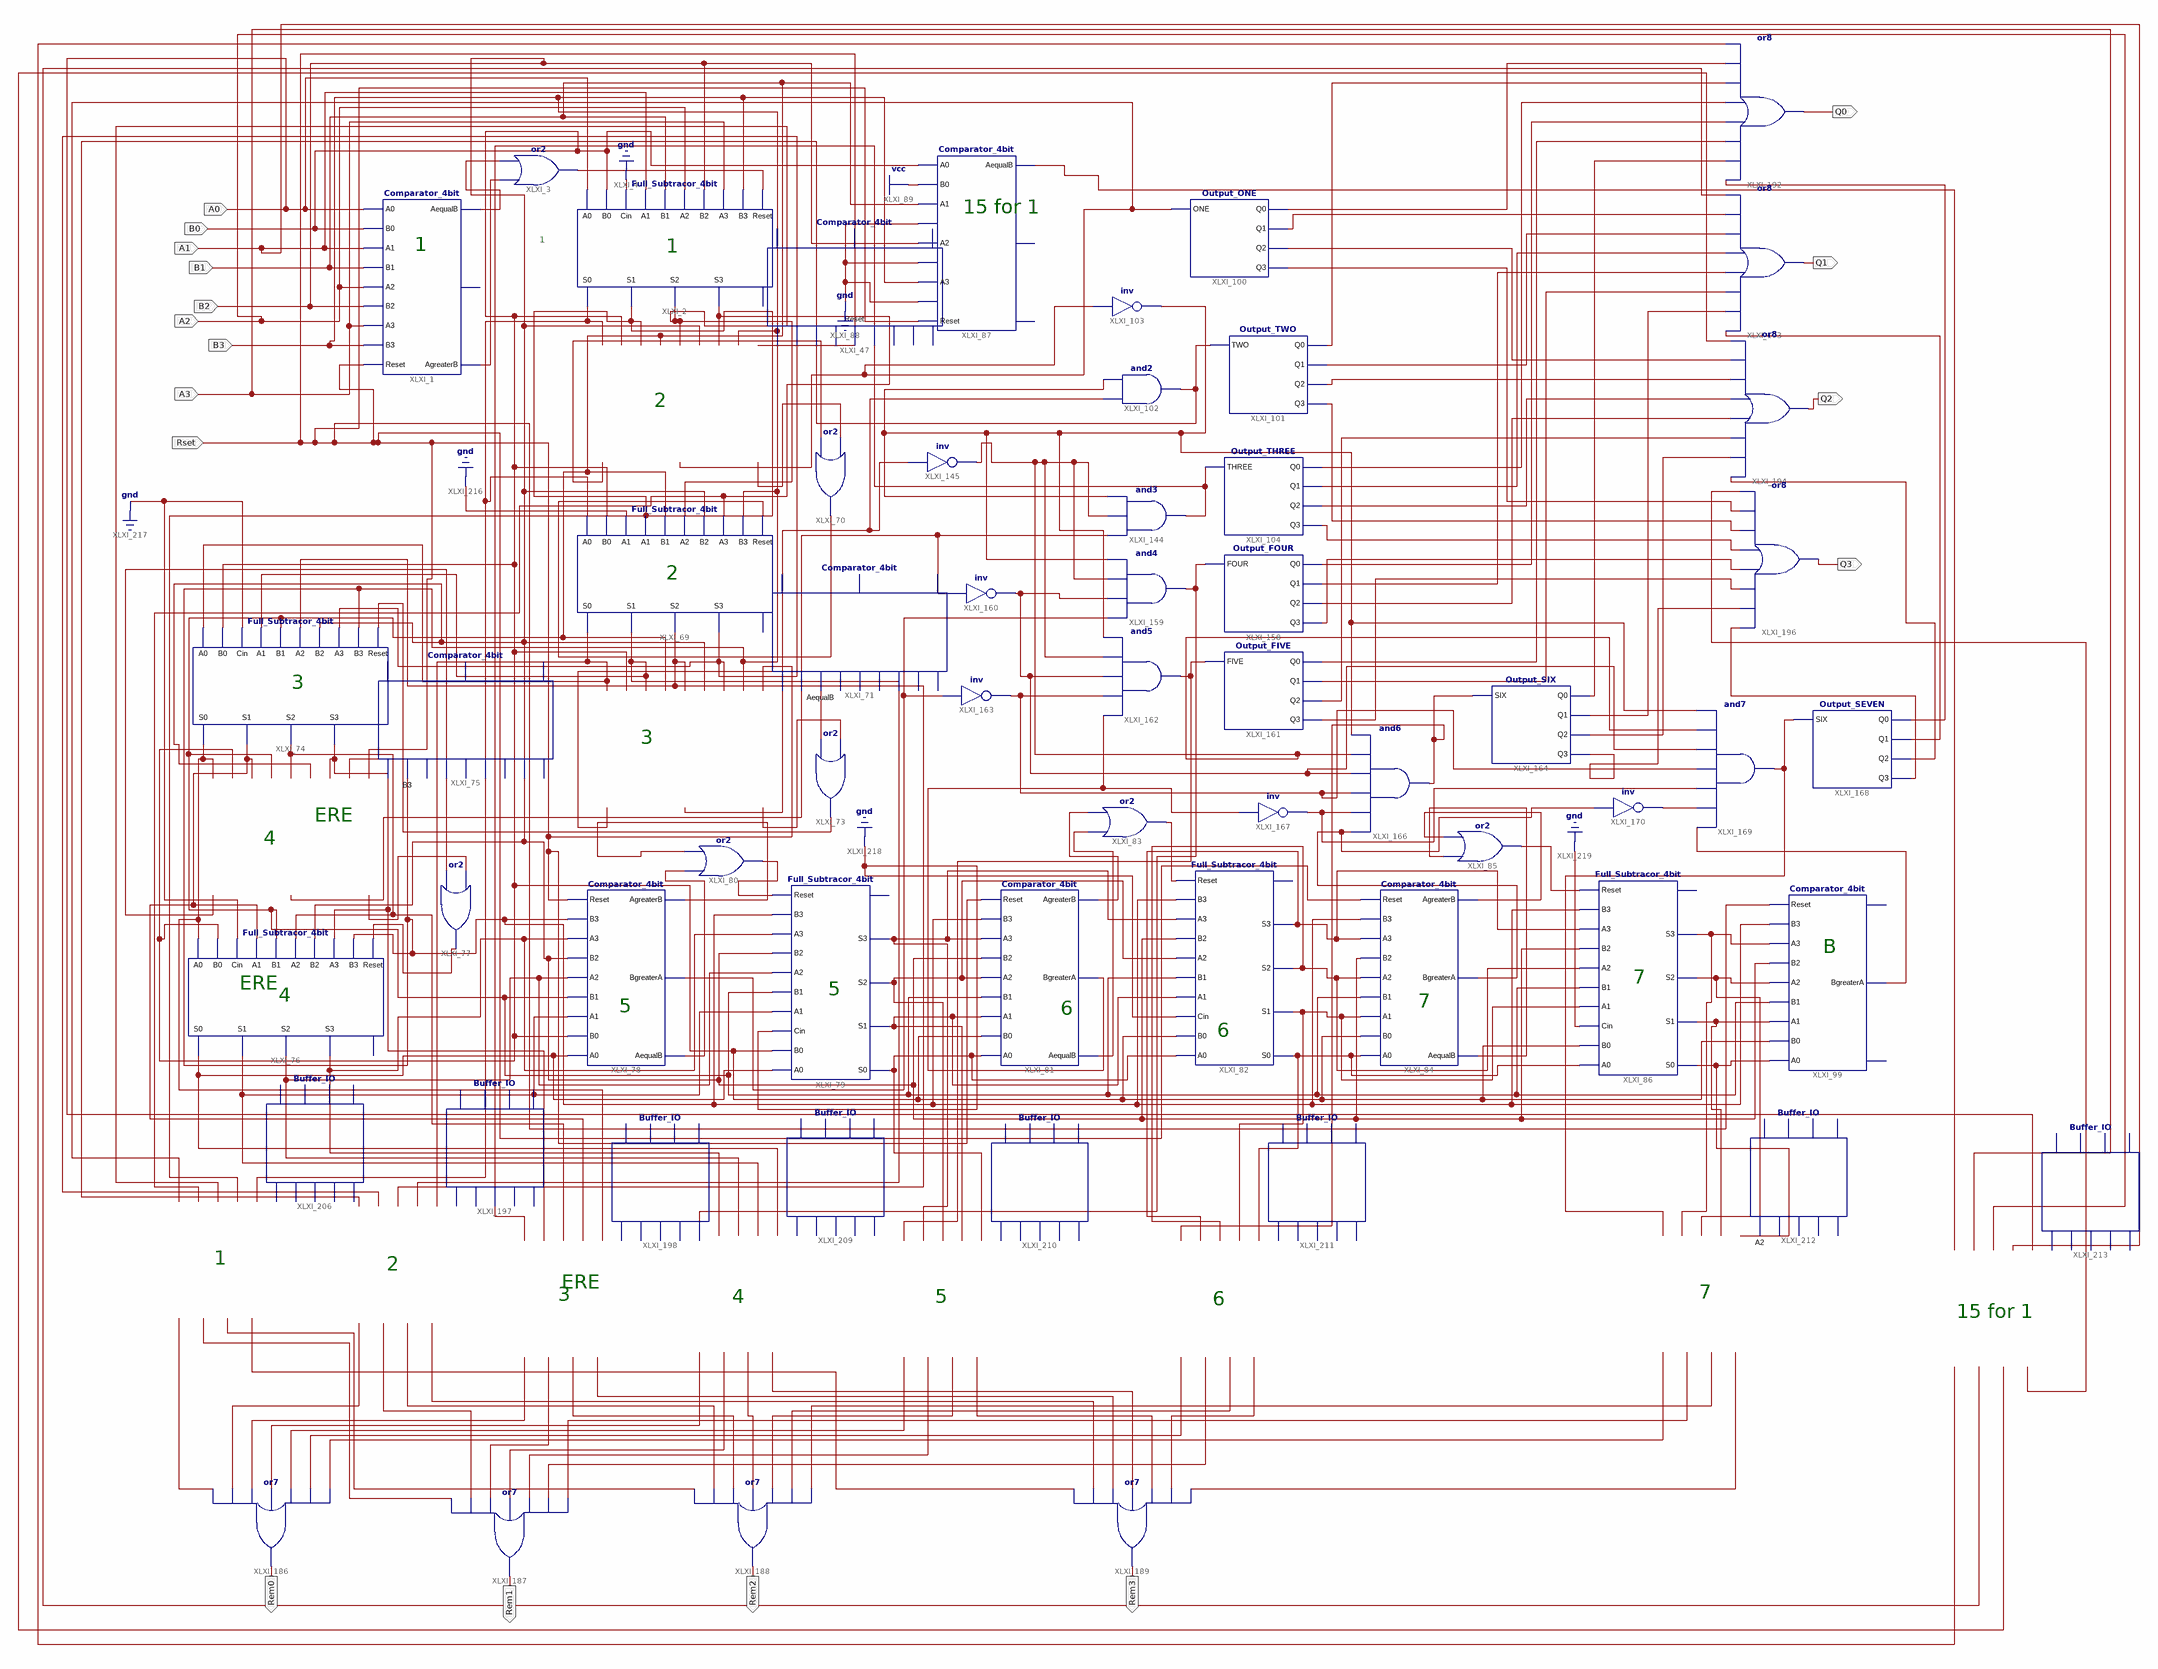
[diagram p0: schematic sheet 1]
// Xilinx ISE schematic Divider_2att.sch (artix7) as structural Verilog: 58 symbols, 17 ports
module Divider_2att (
  input  A2,
  input  A3,
  input  A1,
  input  A0,
  input  B0,
  input  B1,
  input  B2,
  input  B3,
  input  Rset,
  output Q0,
  output Q1,
  output Q2,
  output Rem0,
  output Rem1,
  output Rem2,
  output Rem3,
  output Q3
);

  wire XLXN_6, XLXN_7, XLXN_8, XLXN_124, XLXN_125, XLXN_130, XLXN_131, XLXN_136, XLXN_138, XLXN_139,
       XLXN_140, XLXN_142, XLXN_144, XLXN_151, XLXN_154, XLXN_163, XLXN_165, XLXN_167, XLXN_171, XLXN_172,
       XLXN_174, XLXN_176, XLXN_177, XLXN_178, XLXN_179, XLXN_180, XLXN_184, XLXN_185, XLXN_186, XLXN_193,
       XLXN_194, XLXN_195, XLXN_205, XLXN_208, XLXN_210, XLXN_216, XLXN_313, XLXN_334, XLXN_335, XLXN_337,
       XLXN_339, XLXN_340, XLXN_348, XLXN_350, XLXN_351, XLXN_352, XLXN_353, XLXN_354, XLXN_357, XLXN_358,
       XLXN_359, XLXN_361, XLXN_362, XLXN_363, XLXN_364, XLXN_365, XLXN_366, XLXN_368, XLXN_370, XLXN_371,
       XLXN_372, XLXN_373, XLXN_374, XLXN_375, XLXN_376, XLXN_377, XLXN_378, XLXN_379, XLXN_380, XLXN_381,
       XLXN_382, XLXN_383, XLXN_390, XLXN_395, XLXN_397, XLXN_398, XLXN_403, XLXN_404, XLXN_405, XLXN_406,
       XLXN_407, XLXN_408, XLXN_410, XLXN_416, XLXN_419, XLXN_421, XLXN_422, XLXN_423, XLXN_424, XLXN_425,
       XLXN_426, XLXN_427, XLXN_428, XLXN_429, XLXN_430, XLXN_431, XLXN_432, XLXN_433, XLXN_434, XLXN_435,
       XLXN_436, XLXN_440, XLXN_441, XLXN_442, XLXN_443, XLXN_444, XLXN_445, XLXN_446, XLXN_447, XLXN_448,
       XLXN_449, XLXN_450, XLXN_458, XLXN_462, XLXN_472, XLXN_473, XLXN_474, XLXN_475, XLXN_476, XLXN_477,
       XLXN_478, XLXN_492, XLXN_493, XLXN_536, XLXN_537, XLXN_538, XLXN_539, XLXN_545, XLXN_557;

  Comparator_4bit XLXI_1 (
    .A0(A0), .B0(B0), .A1(A1), .B1(B1), .A2(A2), .B2(B2), .A3(A3), .B3(B3), .Reset(Rset), .AequalB(XLXN_7),
    .AgreaterB(XLXN_6));  // open: BgreaterA
  Full_Subtracor_4bit XLXI_2 (
    .Reset(XLXN_8), .B3(B3), .A3(A3), .B2(B2), .A2(A2), .B1(B1), .A1(A1), .Cin(1'b0), .B0(B0), .A0(A0),
    .S3(XLXN_398), .S2(XLXN_397), .S1(XLXN_557), .S0(XLXN_395));  // open: Cout
  or XLXI_3 (XLXN_8, XLXN_6, XLXN_7);
  Comparator_4bit XLXI_47 (
    .A0(XLXN_395), .B0(B0), .A1(XLXN_557), .B1(B1), .A2(XLXN_397), .B2(B2), .A3(XLXN_398), .B3(B3),
    .Reset(Rset), .AequalB(XLXN_125), .BgreaterA(XLXN_410), .AgreaterB(XLXN_124));
  Full_Subtracor_4bit XLXI_69 (
    .Reset(XLXN_130), .B3(B3), .A3(XLXN_398), .B2(B2), .A2(XLXN_397), .B1(B1), .A1(XLXN_557), .Cin(1'b0),
    .B0(B0), .A0(XLXN_395), .S3(XLXN_144), .S2(XLXN_136), .S1(XLXN_142), .S0(XLXN_131));  // open: Cout
  or XLXI_70 (XLXN_130, XLXN_125, XLXN_124);
  Comparator_4bit XLXI_71 (
    .A0(XLXN_131), .B0(B0), .A1(XLXN_142), .B1(B1), .A2(XLXN_136), .B2(B2), .A3(XLXN_144), .B3(B3),
    .Reset(Rset), .AequalB(XLXN_139), .BgreaterA(XLXN_313), .AgreaterB(XLXN_138));
  or XLXI_73 (XLXN_140, XLXN_139, XLXN_138);
  Full_Subtracor_4bit XLXI_74 (
    .Reset(XLXN_140), .B3(B3), .A3(XLXN_144), .B2(B2), .A2(XLXN_136), .B1(B1), .A1(XLXN_142), .Cin(1'b0),
    .B0(B0), .A0(XLXN_131), .S3(XLXN_536), .S2(XLXN_537), .S1(XLXN_538), .S0(XLXN_539));  // open: Cout
  or XLXI_77 (XLXN_154, XLXN_545, XLXN_151);
  Full_Subtracor_4bit XLXI_76 (
    .Reset(XLXN_154), .B3(B3), .A3(XLXN_536), .B2(B2), .A2(XLXN_537), .B1(B1), .A1(XLXN_538), .Cin(1'b0),
    .B0(B0), .A0(XLXN_539), .S3(XLXN_167), .S2(XLXN_165), .S1(XLXN_163), .S0(XLXN_176));  // open: Cout
  Comparator_4bit XLXI_78 (
    .A0(XLXN_176), .B0(B0), .A1(XLXN_163), .B1(B1), .A2(XLXN_165), .B2(B2), .A3(XLXN_167), .B3(B3),
    .Reset(Rset), .AequalB(XLXN_172), .BgreaterA(XLXN_339), .AgreaterB(XLXN_171));
  Full_Subtracor_4bit XLXI_79 (
    .Reset(XLXN_174), .B3(B3), .A3(XLXN_167), .B2(B2), .A2(XLXN_165), .B1(B1), .A1(XLXN_163), .Cin(1'b0),
    .B0(B0), .A0(XLXN_176), .S3(XLXN_180), .S2(XLXN_179), .S1(XLXN_178), .S0(XLXN_177));  // open: Cout
  or XLXI_80 (XLXN_174, XLXN_172, XLXN_171);
  or XLXI_83 (XLXN_186, XLXN_185, XLXN_184);
  Comparator_4bit XLXI_84 (
    .A0(XLXN_403), .B0(B0), .A1(XLXN_404), .B1(B1), .A2(XLXN_405), .B2(B2), .A3(XLXN_406), .B3(B3),
    .Reset(Rset), .AequalB(XLXN_194), .BgreaterA(XLXN_350), .AgreaterB(XLXN_193));
  Full_Subtracor_4bit XLXI_82 (
    .Reset(XLXN_186), .B3(B3), .A3(XLXN_180), .B2(B2), .A2(XLXN_179), .B1(B1), .A1(XLXN_178), .Cin(1'b0),
    .B0(B0), .A0(XLXN_177), .S3(XLXN_406), .S2(XLXN_405), .S1(XLXN_404), .S0(XLXN_403));  // open: Cout
  or XLXI_85 (XLXN_195, XLXN_194, XLXN_193);
  Full_Subtracor_4bit XLXI_86 (
    .Reset(XLXN_195), .B3(B3), .A3(XLXN_406), .B2(B2), .A2(XLXN_405), .B1(B1), .A1(XLXN_404), .Cin(1'b0),
    .B0(B0), .A0(XLXN_403), .S3(XLXN_408), .S2(XLXN_407), .S1(XLXN_208), .S0(XLXN_210));  // open: Cout
  Comparator_4bit XLXI_87 (
    .A0(B0), .B0(1'b1), .A1(B1), .B1(1'b0), .A2(B2), .B2(1'b0), .A3(B3), .B3(1'b0), .Reset(Rset),
    .AequalB(XLXN_205));  // open: BgreaterA, AgreaterB
  Comparator_4bit XLXI_99 (
    .A0(XLXN_210), .B0(B0), .A1(XLXN_208), .B1(B1), .A2(XLXN_407), .B2(B2), .A3(XLXN_408), .B3(B3),
    .Reset(Rset), .BgreaterA(XLXN_358));  // open: AequalB, AgreaterB
  Output_ONE XLXI_100 (.ONE(XLXN_410), .Q0(XLXN_361), .Q1(XLXN_370), .Q2(XLXN_377), .Q3(XLXN_477));
  Output_TWO XLXI_101 (.TWO(XLXN_216), .Q0(XLXN_362), .Q1(XLXN_371), .Q2(XLXN_378), .Q3(XLXN_476));
  and XLXI_102 (XLXN_216, XLXN_313, XLXN_335);
  not XLXI_103 (XLXN_335, XLXN_410);
  not XLXI_145 (XLXN_354, XLXN_313);
  and XLXI_144 (XLXN_416, XLXN_337, XLXN_354, XLXN_335);
  Output_THREE XLXI_104 (.THREE(XLXN_416), .Q0(XLXN_363), .Q1(XLXN_372), .Q2(XLXN_379), .Q3(XLXN_475));
  Output_FOUR XLXI_158 (.FOUR(XLXN_334), .Q0(XLXN_364), .Q1(XLXN_373), .Q2(XLXN_381), .Q3(XLXN_474));
  and XLXI_159 (XLXN_334, XLXN_339, XLXN_353, XLXN_354, XLXN_335);
  not XLXI_160 (XLXN_353, XLXN_337);
  Output_FIVE XLXI_161 (.FIVE(XLXN_340), .Q0(XLXN_365), .Q1(XLXN_374), .Q2(XLXN_380), .Q3(XLXN_473));
  and XLXI_162 (XLXN_340, XLXN_348, XLXN_352, XLXN_353, XLXN_354, XLXN_335);
  not XLXI_163 (XLXN_352, XLXN_339);
  Output_SIX XLXI_164 (.SIX(XLXN_419), .Q0(XLXN_366), .Q1(XLXN_375), .Q2(XLXN_382), .Q3(XLXN_472));
  and XLXI_166 (XLXN_419, XLXN_350, XLXN_351, XLXN_352, XLXN_353, XLXN_354, XLXN_335);
  not XLXI_167 (XLXN_351, XLXN_348);
  Output_SEVEN XLXI_168 (.SIX(XLXN_357), .Q0(XLXN_368), .Q1(XLXN_376), .Q2(XLXN_383), .Q3(XLXN_390));
  and XLXI_169 (XLXN_357, XLXN_358, XLXN_359, XLXN_351, XLXN_352, XLXN_353, XLXN_354, XLXN_335);
  not XLXI_170 (XLXN_359, XLXN_350);
  or XLXI_186 (Rem0, XLXN_421, XLXN_422, XLXN_423, XLXN_424, XLXN_425, XLXN_426, XLXN_427);
  or XLXI_187 (Rem1, XLXN_428, XLXN_429, XLXN_430, XLXN_431, XLXN_432, XLXN_433, XLXN_434);
  or XLXI_188 (Rem2, XLXN_435, XLXN_436, XLXN_493, XLXN_440, XLXN_441, XLXN_442, XLXN_443);
  or XLXI_189 (Rem3, XLXN_444, XLXN_445, XLXN_446, XLXN_447, XLXN_448, XLXN_449, XLXN_450);
  or XLXI_192 (Q0, XLXN_458, XLXN_361, XLXN_362, XLXN_363, XLXN_364, XLXN_365, XLXN_366, XLXN_368);
  or XLXI_193 (Q1, XLXN_462, XLXN_370, XLXN_371, XLXN_372, XLXN_373, XLXN_374, XLXN_375, XLXN_376);
  or XLXI_194 (Q2, XLXN_492, XLXN_377, XLXN_378, XLXN_379, XLXN_381, XLXN_380, XLXN_382, XLXN_383);
  or XLXI_196 (Q3, XLXN_478, XLXN_477, XLXN_476, XLXN_475, XLXN_474, XLXN_473, XLXN_472, XLXN_390);
  Buffer_IO XLXI_206 (
    .Enable(XLXN_410), .A3(XLXN_398), .A2(XLXN_397), .A1(XLXN_557), .A0(XLXN_395), .B0(XLXN_421),
    .B1(XLXN_428), .B2(XLXN_435), .B3(XLXN_444));
  Buffer_IO XLXI_197 (
    .Enable(XLXN_216), .A3(XLXN_144), .A2(XLXN_136), .A1(XLXN_142), .A0(XLXN_131), .B0(XLXN_422),
    .B1(XLXN_429), .B2(XLXN_436), .B3(XLXN_445));
  Buffer_IO XLXI_198 (
    .Enable(XLXN_416), .A3(XLXN_536), .A2(XLXN_537), .A1(XLXN_538), .A0(XLXN_539), .B0(XLXN_423),
    .B1(XLXN_430), .B2(XLXN_493), .B3(XLXN_446));
  Buffer_IO XLXI_209 (
    .Enable(XLXN_334), .A3(XLXN_167), .A2(XLXN_165), .A1(XLXN_163), .A0(XLXN_176), .B0(XLXN_424),
    .B1(XLXN_431), .B2(XLXN_440), .B3(XLXN_447));
  Buffer_IO XLXI_210 (
    .Enable(XLXN_340), .A3(XLXN_180), .A2(XLXN_179), .A1(XLXN_178), .A0(XLXN_177), .B0(XLXN_425),
    .B1(XLXN_432), .B2(XLXN_441), .B3(XLXN_448));
  Buffer_IO XLXI_211 (
    .Enable(XLXN_419), .A3(XLXN_406), .A2(XLXN_405), .A1(XLXN_404), .A0(XLXN_403), .B0(XLXN_426),
    .B1(XLXN_433), .B2(XLXN_442), .B3(XLXN_449));
  Buffer_IO XLXI_212 (
    .Enable(XLXN_357), .A3(XLXN_408), .A2(XLXN_407), .A1(XLXN_208), .A0(XLXN_210), .B0(XLXN_427),
    .B1(XLXN_434), .B2(XLXN_443), .B3(XLXN_450));
  Buffer_IO XLXI_213 (
    .Enable(XLXN_205), .A3(A3), .A2(A2), .A1(A1), .A0(A0), .B0(XLXN_458), .B1(XLXN_462), .B2(XLXN_492),
    .B3(XLXN_478));
  Comparator_4bit XLXI_75 (
    .A0(XLXN_539), .B0(B0), .A1(XLXN_538), .B1(B1), .A2(XLXN_537), .B2(B2), .A3(XLXN_536), .B3(B3),
    .Reset(Rset), .AequalB(XLXN_545), .BgreaterA(XLXN_337), .AgreaterB(XLXN_151));
  Comparator_4bit XLXI_81 (
    .A0(XLXN_177), .B0(B0), .A1(XLXN_178), .B1(B1), .A2(XLXN_179), .B2(B2), .A3(XLXN_180), .B3(B3),
    .Reset(Rset), .AequalB(XLXN_185), .BgreaterA(XLXN_348), .AgreaterB(XLXN_184));

  // Notes on the sheet:
  //   15 for 1
  //   1
  //   1
  //   1
  //   2
  //   2
  //   3
  //   3
  //   ERE
  //   4
  //   B
  //   7
  //   ERE
  //   5
  //   4
  //   7
  //   5
  //   6
  //   6
  //   1
  //   2
  //   ERE
  //   7
  //   3
  //   4
  //   5
  //   6
  //   15 for 1
endmodule
